# EAGLE design laserdriver_v3_3_laserswitch (EAGLE 7.5.0)
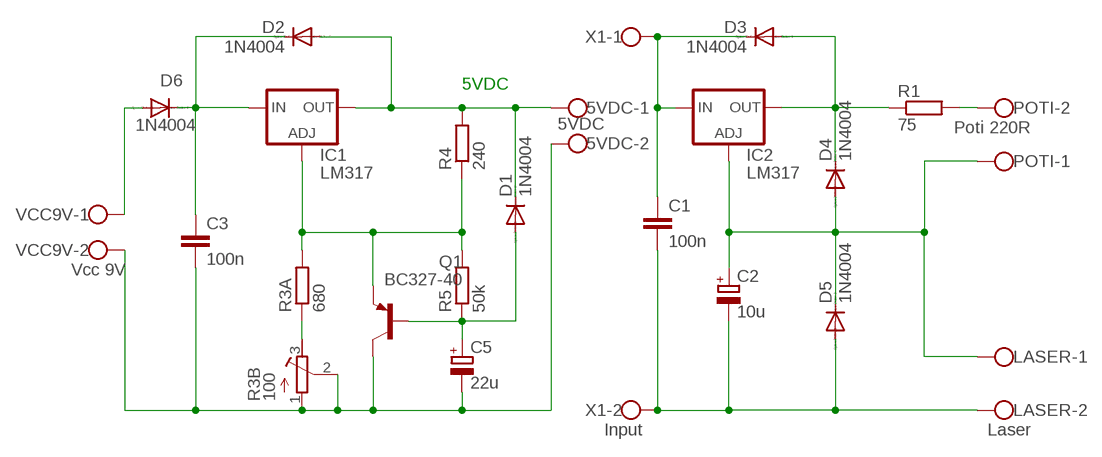
[diagram p0: schematic, sheet 1]

## Parts
5VDC  5VDC  W237-102  [W237-102]
C1  100n  C-EU050-024X044  [C050-024X044]
C2  10u  CPOL-EUE2-5  [E2-5]
C3  100n  C-EU050-024X044  [C050-024X044]
C5  22u  CPOL-EUE2-5  [E2-5]
D1  1N4004  [DO41-10]
D2  1N4004  [DO41-10]
D3  1N4004  [DO41-10]
D4  1N4004  [DO41-10]
D5  1N4004  [DO41-10]
D6  1N4004  [DO41-10]
IC1  LM317  LM317TS  [317TS]
IC2  LM317  LM317TS  [317TS]
LASER  Laser  W237-102  [W237-102]
POTI  Poti 220R  W237-102  [W237-102]
Q1  BC327-40  [TO92-EBC]
R1  75  R-EU_0207/7  [0207/7]
R3A  680  R-EU_0207/7  [0207/7]
R3B  100  R-TRIMM3296W  [RTRIM3296W]
R4  240  R-EU_0207/7  [0207/7]
R5  50k  R-EU_0207/7  [0207/7]
VCC9V  Vcc 9V  W237-102  [W237-102]
X1  Input  W237-102  [W237-102]

## Nets
N$1: 5VDC.1 D1.C D2.A IC1.2(OUT) R4.2
N$2: C2.+ D4.A D5.C IC2.1(ADJ) LASER.1 POTI.1
N$3: D3.A D4.C IC2.2(OUT) R1.1
N$4: POTI.2 R1.2
N$5: C5.+ D1.A Q1.B R5.1
N$6: D6.A VCC9V.1
N$7: C3.1 D2.C D6.C IC1.3(IN)
N$8: R3A.1 R3B.3(E)
N$9: 5VDC.2 C3.2 C5.- Q1.C R3B.1(A) R3B.2(S) VCC9V.2
N$10: C1.1 D3.C IC2.3(IN) X1.1
N$11: C1.2 C2.- D5.A LASER.2 X1.2
N$12: IC1.1(ADJ) Q1.E R3A.2 R4.1 R5.2

## Notes on the sheet
- 5VDC

## Library data of the parts
5VDC LASER POTI VCC9V X1 = con-wago-500:W237-102: WAGO SCREW CLAMP; MPN: 237-102; OC_FARNELL: unknown; OC_NEWARK: 70K9898
C1 C3 = rcl:C-EU: CAPACITOR, European symbol
C2 C5 = rcl:CPOL-EU: POLARIZED CAPACITOR, European symbol
D1-D6 = diode:1N4004: DIODE general purpose rectifier, 1 A
IC1 IC2 = v-reg:LM317TS: VOLTAGE REGULATOR
Q1 = transistor-pnp:BC327*: PNP Transistror
R1 R3A R4 R5 = rcl:R-EU_: RESISTOR, European symbol
R3B = rcl:R-TRIMM: Trimm resistor

## Board
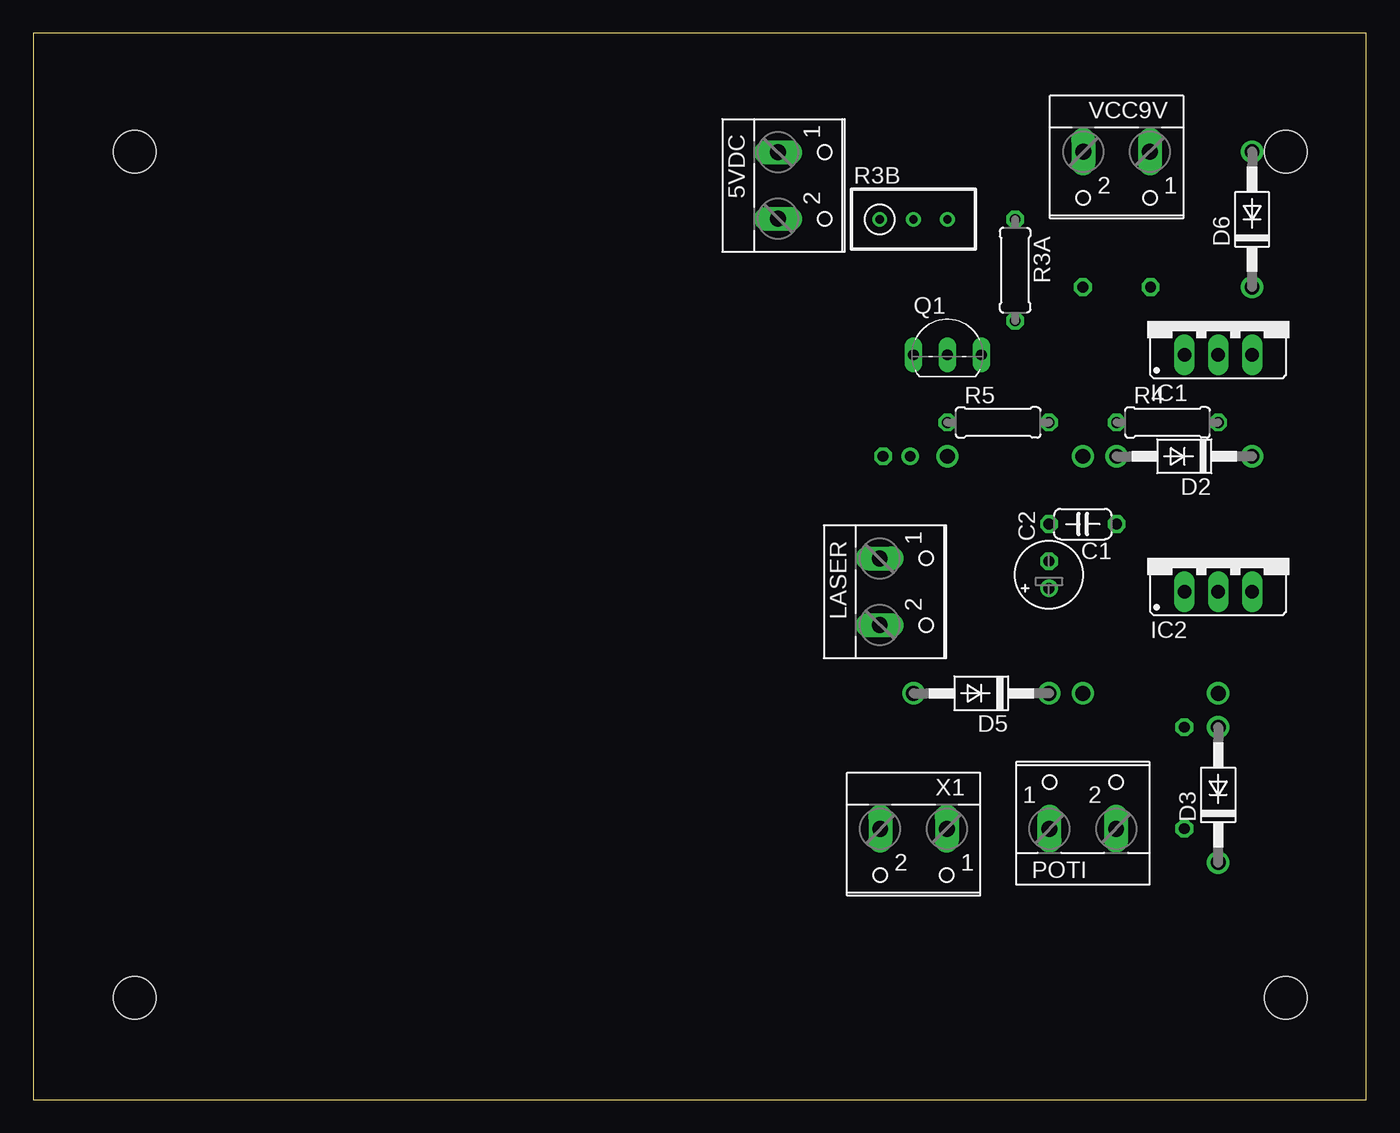
[diagram p1: board, top side]
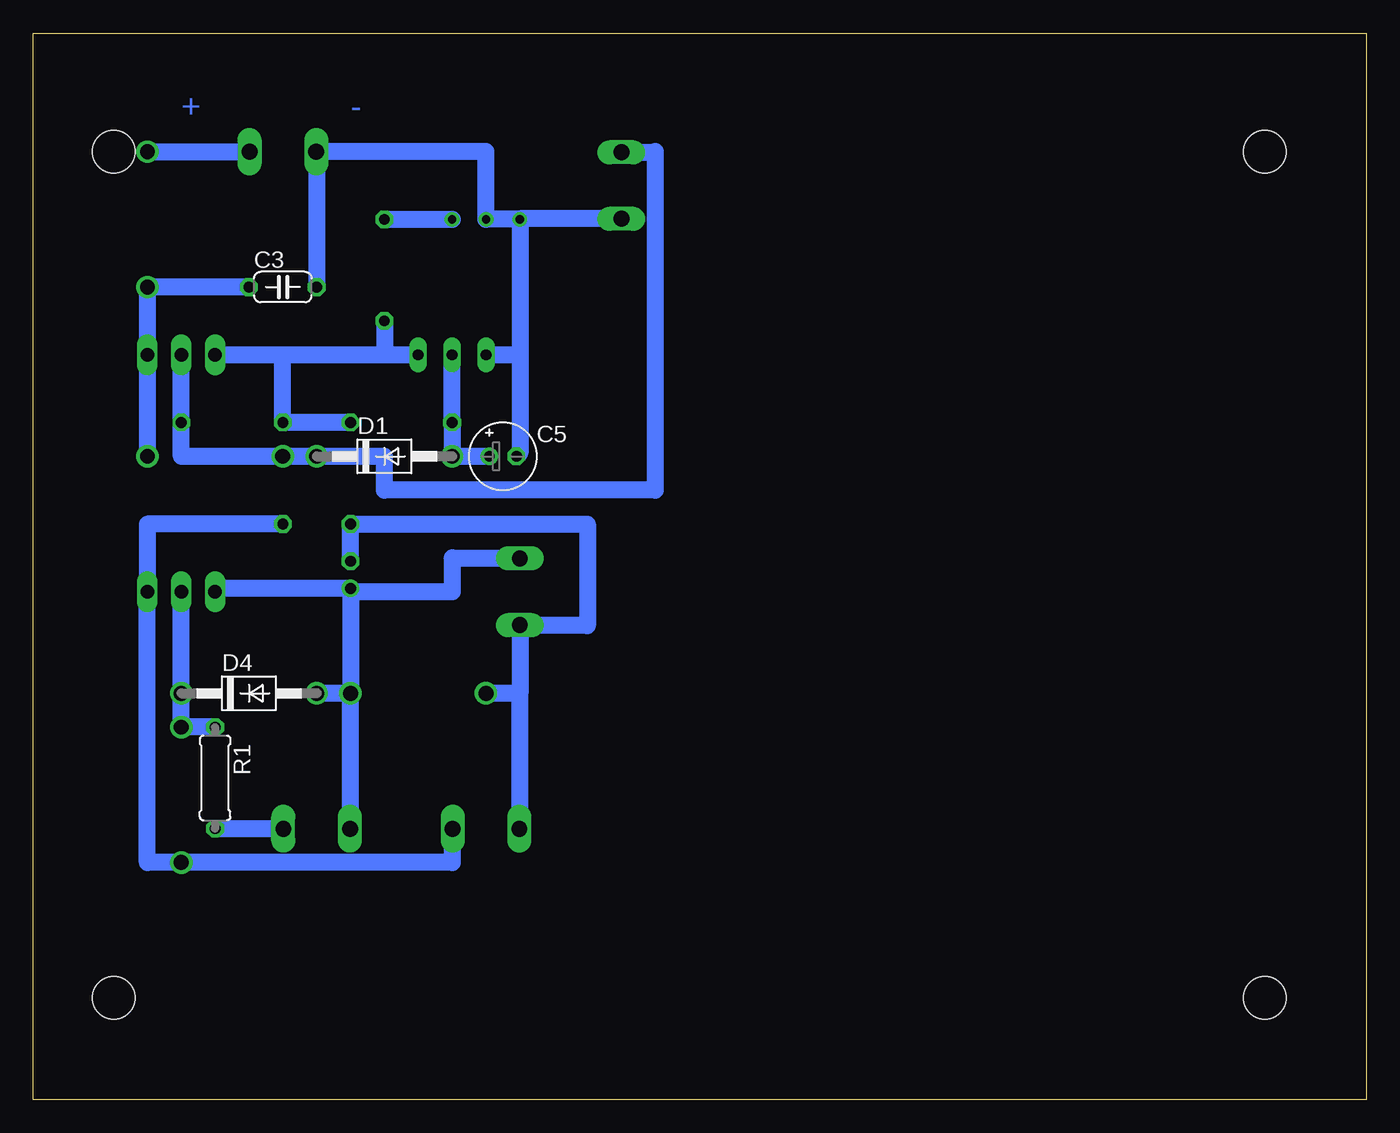
[diagram p2: board, bottom side, seen from below]

Size 100 x 80 mm. Coordinates in mm from the lower left corner, seen from the top.
Outline: 0,0 100,0 100,80 0,80 0,0
Copper layers (1*16): Top 0.035mm / dielectric 1.5mm / Bottom 0.035mm
Design rules "default *": minimum track width 15mil, minimum drill 24mil, track to track 10mil, track to pad 10mil, pad to pad 8mil, via to via 8mil, smd to smd 8mil, copper to edge 40mil, drill to drill 8mil, minimum pad ring 10mil, minimum via ring 8mil, stop-mask expansion 4mil, vias tented up to drill 0mil, thermal gap 10mil
Holes 3.2 mm at 7.62,71.12 93.98,71.12 93.98,7.62 7.62,7.62

### Footprints (pad centres in the part's own frame; a part is rotated, then mirrored left to right if it is on the bottom)
W237-102 = drill 1.194 long: 1 -2.5,-1.27; 2 2.5,-1.27
C050-024X044 = drill 0.813 octagon: 1 -2.54,0; 2 2.54,0
E2-5 = drill 0.813 pad 1.27: + -1.016,0 | drill 0.813 pad 1.27 octagon: - 1.016,0
DO41-10 = drill 1.118: A 5.08,0; C -5.08,0
317TS = drill 1.016 long: 1 -2.54,-2.54; 2 0,-2.54; 3 2.54,-2.54
TO92-EBC = drill 0.813 long: B 0,-1.27; C -2.54,-1.27; E 2.54,-1.27
0207/7 = drill 0.813 octagon: 1 -3.81,0; 2 3.81,0
RTRIM3296W = drill 0.61: 1 0,-2.54; 2 0,0; 3 0,2.54

### Placement (x,y rotation side)
5VDC  57.15,68.58 270 top
C1  78.74,43.18 180 top
C2  76.2,39.37 90 top
C3  81.28,60.96 0 bottom
C5  64.77,48.26 0 bottom
D1  73.66,48.26 0 bottom
D2  86.36,48.26 180 top
D3  88.9,22.86 90 top
D4  83.82,30.48 0 bottom
D5  71.12,30.48 180 top
D6  91.44,66.04 90 top
IC1  88.9,58.42 0 top
IC2  88.9,40.64 0 top
LASER  64.77,38.1 270 top
POTI  78.74,21.59 0 top
Q1  68.58,57.15 0 top
R1  86.36,24.13 270 bottom
R3A  73.66,62.23 270 top
R3B  66.04,66.04 270 top
R4  85.09,50.8 0 top
R5  72.39,50.8 0 top
VCC9V  81.28,69.85 180 top
X1  66.04,19.05 180 top

### Tracks (layer width: path | path; a pad name or v marks a point on that pad's centre or on a via)
N$1
  Bottom 1.27: IC1.2 R4.2 88.9,48.26 D2.A D1.C 73.66,48.26 73.66,45.72 53.34,45.72 53.34,71.08 | 5VDC.1 53.34,71.08 | 53.34,71.08 53.34,71.12
N$2
  Bottom 1.27: D5.C D4.A | C2.+ 86.11,38.35 IC2.1 | C2.+ D5.C | D5.C 76.24,30.48 POTI.1 | LASER.1 68.58,40.6 | 68.58,40.6 68.58,40.64 | 68.58,40.6 68.58,38.1 76.2,38.1 C2.+
N$3
  Bottom 1.27: IC2.2 D4.C D3.A R1.1
N$4
  Bottom 1.27: POTI.2 R1.2
N$5
  Bottom 1.27: Q1.B R5.1 D1.A C5.+
N$6
  Bottom 1.016: 83.78,71.16 83.82,71.12
  Bottom 1.27: D6.A 83.82,71.12 | VCC9V.1 83.78,71.16
N$7
  Bottom 1.27: D2.C IC1.3 D6.C C3.1
N$8
  Bottom 1.27: R3A.1 R3B.3
N$9
  Bottom 0.813: 78.74,71.12 VCC9V.2
  Bottom 1.27: 78.74,71.12 C3.2 | VCC9V.2 66.04,71.12 R3B.2 R3B.1 | Q1.C 63.5,55.88 | 63.5,55.88 63.5,48.51 C5.- | R3B.1 63.5,55.88 | 5VDC.2 63.5,66.08 R3B.1
N$10
  Bottom 1.27: C1.1 91.44,43.18 IC2.3 91.44,17.78 D3.C 68.58,17.78 68.58,20.32 X1.1
N$11
  Bottom 1.27: 63.5,30.48 LASER.2 63.5,35.56 58.42,35.56 58.42,43.18 C1.2 C2.- | 63.5,30.48 D5.A | X1.2 63.5,20.32 63.5,30.48
N$12
  Bottom 1.27: R3A.2 73.66,55.88 | IC1.1 81.28,55.88 | 81.28,55.88 73.66,55.88 | 73.66,55.88 Q1.E | R5.2 R4.1 81.28,55.88

### Text on the board
Bottom: - | +